# Altium schematic sheet other.SchDoc
size A4
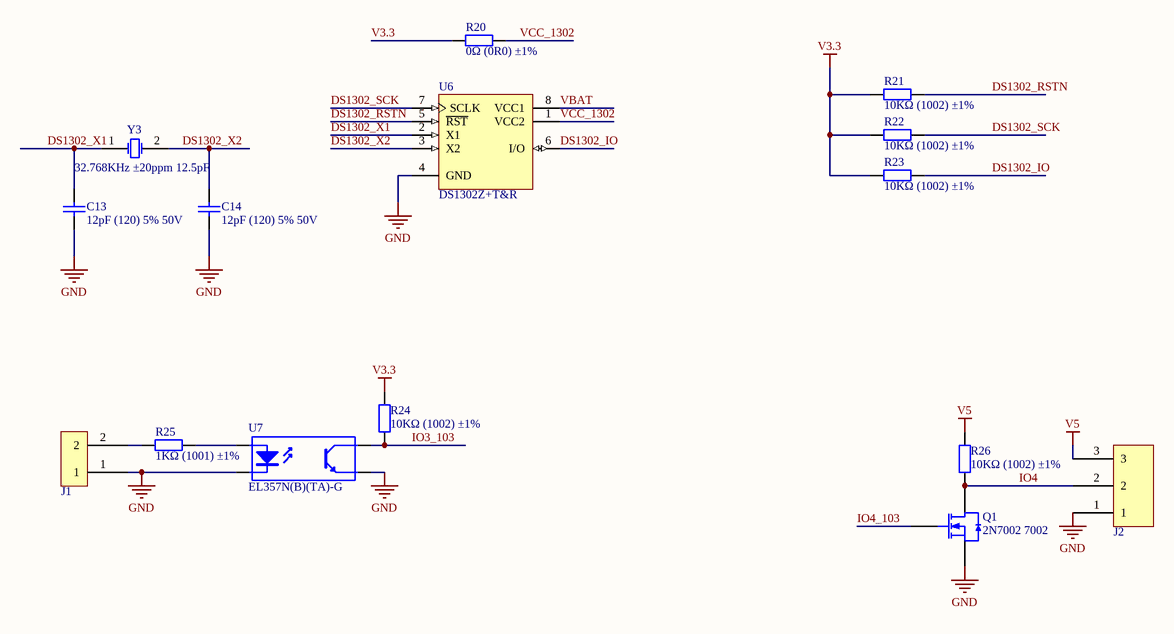
[diagram p0: other.SchDoc]

## Parts
C13  12pF (120) 5% 50V  [0603_C]
C14  12pF (120) 5% 50V  [0603_C]
J1  KF301-2P  [KF301-2P]  (value not drawn)
J2  KF301-3P  [KF301-3P]  (value not drawn)
Q1  2N7002 7002  [SOT-23(SOT-23-3)]
R20  0Ω (0R0) ±1%  [1206_R]
R21  10KΩ (1002) ±1%  [0603_R]
R22  10KΩ (1002) ±1%  [0603_R]
R23  10KΩ (1002) ±1%  [0603_R]
R24  10KΩ (1002) ±1%  [1206_R]
R25  1KΩ (1001) ±1%  [1206_R]
R26  10KΩ (1002) ±1%  [1206_R]
U6  DS1302Z+T&R  [SOIC-8_150mil]
U7  EL357N(B)(TA)-G  [SOP-4_P2.54]
Y3  32.768KHz ±20ppm 12.5pF  [SMD-3215_2P FC - 135]

## Nets
GND: C13.1 C14.1 J1.1 J2.1 Q1.2(S) U6.4(GND) U7.2(K) U7.3(E)
V3.3: R20.1 R21.1 R22.1 R23.1 R24.2
V5: J2.3 R26.2
DS1302_IO: R23.2 U6.6(I/O)
DS1302_RSTN: R21.2 U6.5(~{RST})
DS1302_SCK: R22.2 U6.7(SCLK)
DS1302_X1: C13.2 U6.2(X1) Y3.1(OSC1)
DS1302_X2: C14.2 U6.3(X2) Y3.2(OSC2)
IO3_103: R24.1 U7.4(C)
IO4: J2.2 Q1.3(D) R26.1
IO4_103: Q1.1(G)
VBAT: U6.8(VCC1)
VCC_1302: R20.2 U6.1(VCC2)
NetJ1_2: J1.2 R25.1
NetR25_2: R25.2 U7.1(A)

## Library data of the parts
C13 C14 = 0603 12pF (120) 5% 50V: 贴片电容; ComponentLink1Description: 供应商链接; ComponentLink1URL: http://www.szlcsc.com/product/details_39506.html; Package: 0603; Supplier: LC; SuppliersPartNumber: C38523
Q1 = 2N7002 7002: MOS(场效应管); ComponentLink1Description: 供应商链接; ComponentLink1URL: http://www.szlcsc.com/product/details_9040.html; Package: SOT-23(SOT-23-3); Supplier: LC; SuppliersPartNumber: C8545
R20 = 1206 0Ω (0R0) 1%: 贴片电阻; ComponentLink1Description: 供应商链接; ComponentLink1URL: http://www.szlcsc.com/product/details_18576.html; Package: 1206; Supplier: LC; SuppliersPartNumber: C17888
R21-R23 = 0603 10KΩ (1002) 1%: 贴片电阻; ComponentLink1Description: 供应商链接; ComponentLink1URL: http://www.szlcsc.com/product/details_26547.html; Package: 0603; Supplier: LC; SuppliersPartNumber: C25804
R24 R26 = 1206 10KΩ (1002) 1%: 贴片电阻; ComponentLink1Description: 供应商链接; ComponentLink1URL: http://www.szlcsc.com/product/details_18590.html; Package: 1206; Supplier: LC; SuppliersPartNumber: C17902
R25 = 1206 1KΩ (1001) 1%: 贴片电阻; ComponentLink1Description: 供应商链接; ComponentLink1URL: http://www.szlcsc.com/product/details_4817.html; Package: 1206; Supplier: LC; SuppliersPartNumber: C4410
U6 = DS1302Z+T&R_[C8959]: 实时时钟; ComponentLink1Description: 供应商链接; ComponentLink1URL: http://www.szlcsc.com/product/details_9478.html; Package: SOIC-8_150mil; Supplier: LC; SuppliersPartNumber: C8959
U7 = EL357N(B)(TA)-G_[C6649]: 贴片光耦; ComponentLink1Description: 供应商链接; ComponentLink1URL: http://www.szlcsc.com/product/details_7114.html; Package: SOP-4_P2.54; Supplier: LC; SuppliersPartNumber: C6649
Y3 = SMD-3215_2P 32.768KHz 20ppm 12.5pF: 贴片晶振; ComponentLink1Description: 供应商链接; ComponentLink1URL: http://www.szlcsc.com/product/details_33310.html; Package: SMD-3215_2P; Supplier: LC; SuppliersPartNumber: C32346